# EAGLE schematic FULL_BRIDGE_RECTIFIER (EAGLE 9.3.0)
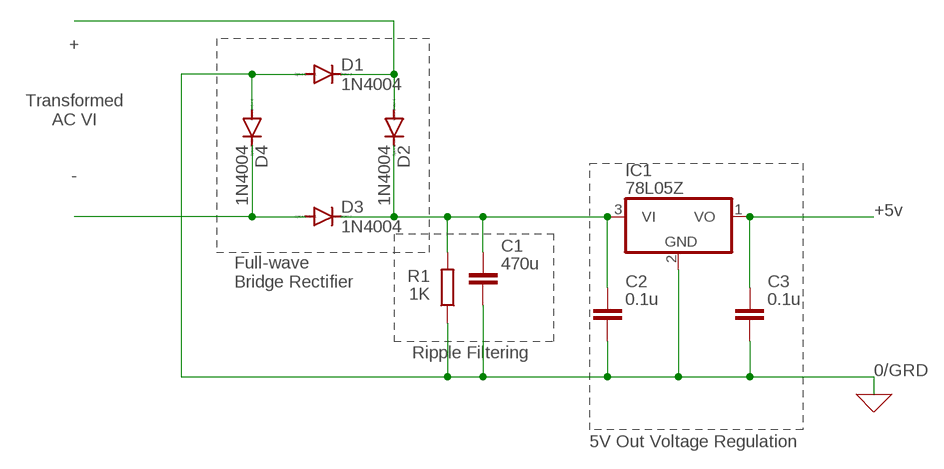
[diagram p0: schematic, sheet 1]

## Parts
C1  470u  C  (no package)
C2  0.1u  C  (no package)
C3  0.1u  C  (no package)
D1  1N4004  [DO41-10]
D2  1N4004  [DO41-10]
D3  1N4004  [DO41-10]
D4  1N4004  [DO41-10]
IC1  78L05Z  [TO92]
R1  1K  R  (no package)

## Nets
0: C1.2 C2.2 C3.2 D1.A D4.A IC1.2(GND) R1.1 ; supply symbol labelled GND
N$2: C3.1 IC1.1(VO)
N$3: D1.C D2.A
N$4: C1.1 C2.1 D2.C D3.C IC1.3(VI) R1.2
N$5: D3.A D4.C

## Notes on the sheet
- +
  
  
  Transformed
  AC VI
  
  
  -
- +5v
- Full-wave 
  Bridge Rectifier
- Ripple Filtering
- 0/GRD
- 5V Out Voltage Regulation

## Library data of the parts
C1-C3 = ngspice-simulation:C: CAPACITOR
D1-D4 = diode:1N4004: DIODE general purpose rectifier, 1 A
IC1 = linear:78*: Positive VOLTAGE REGULATOR Source: http://cache.national.com/ds/LM/LM78L05.pdf http://www.fairchildsemi.com/ds/LM/LM7805.pdf
R1 = ngspice-simulation:R: RESISTOR